# EAGLE design bread_board (EAGLE 8.3.2)
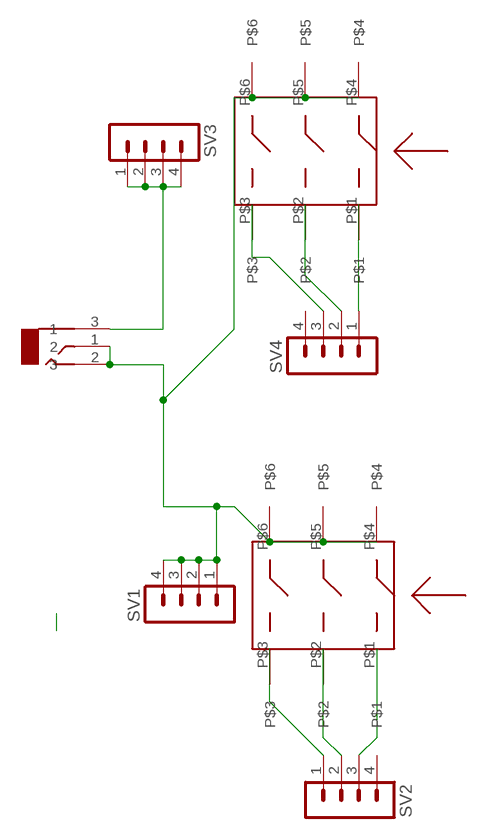
[diagram p0: schematic, sheet 1]

## Parts
J2  DC_JACK  [DC_JACK]
SV1  MA04-1  [MA04-1]
SV2  MA04-1  [MA04-1]
SV3  MA04-1  [MA04-1]
SV4  MA04-1  [MA04-1]
U$1  AUDIO_JACK  [AUDIO_JACK]
U$2  AUDIO_JACK  [AUDIO_JACK]

## Nets
GND: J2.1 J2.2 SV1.1 SV1.2 SV1.3 SV1.4 U$1.P$4 U$1.P$5 U$1.P$6 U$2.P$4 U$2.P$5 U$2.P$6
N$2: SV2.3 U$2.P$1
N$4: J2.3 SV3.1 SV3.2 SV3.3 SV3.4
N$5: SV2.2 U$2.P$2
N$6: SV2.1 U$2.P$3
N$7: SV4.1 U$1.P$1
N$8: SV4.2 U$1.P$2
N$9: SV4.3 U$1.P$3
Unconnected: SV2.4 SV4.4

## Library data of the parts
J2 = untitled:DC_JACK
SV1-SV4 = con-lstb:MA04-1: PIN HEADER; OC_FARNELL: unknown; OC_NEWARK: unknown
U$1 U$2 = untitled:AUDIO_JACK: General purpose 1/4 inch audio jack for amplifiers and pedal designs

## Board
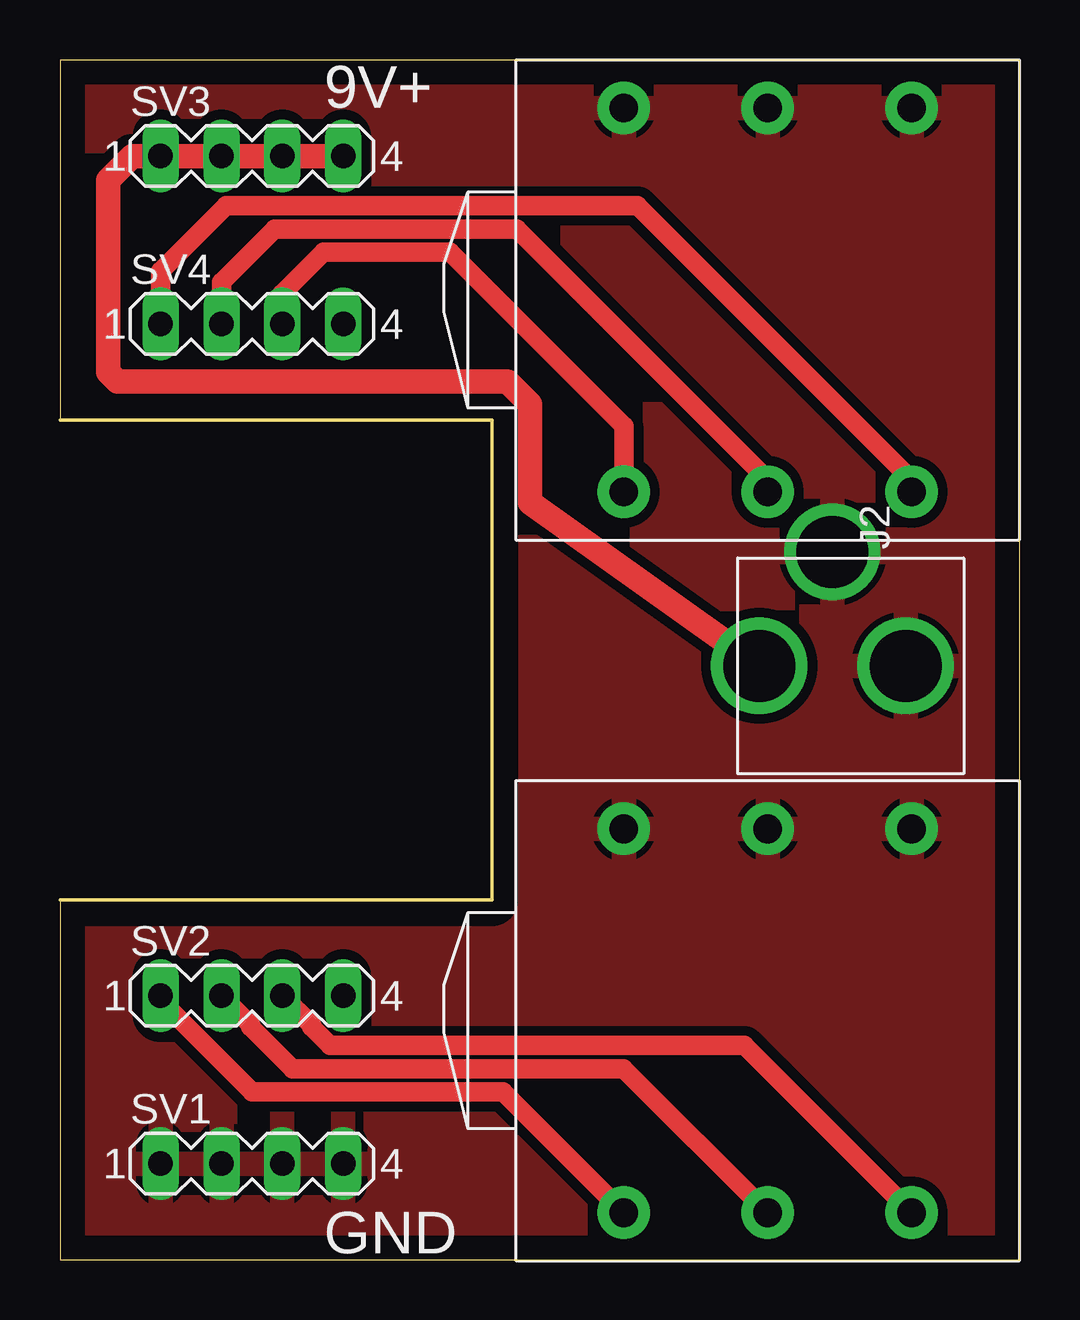
[diagram p1: board, top side]
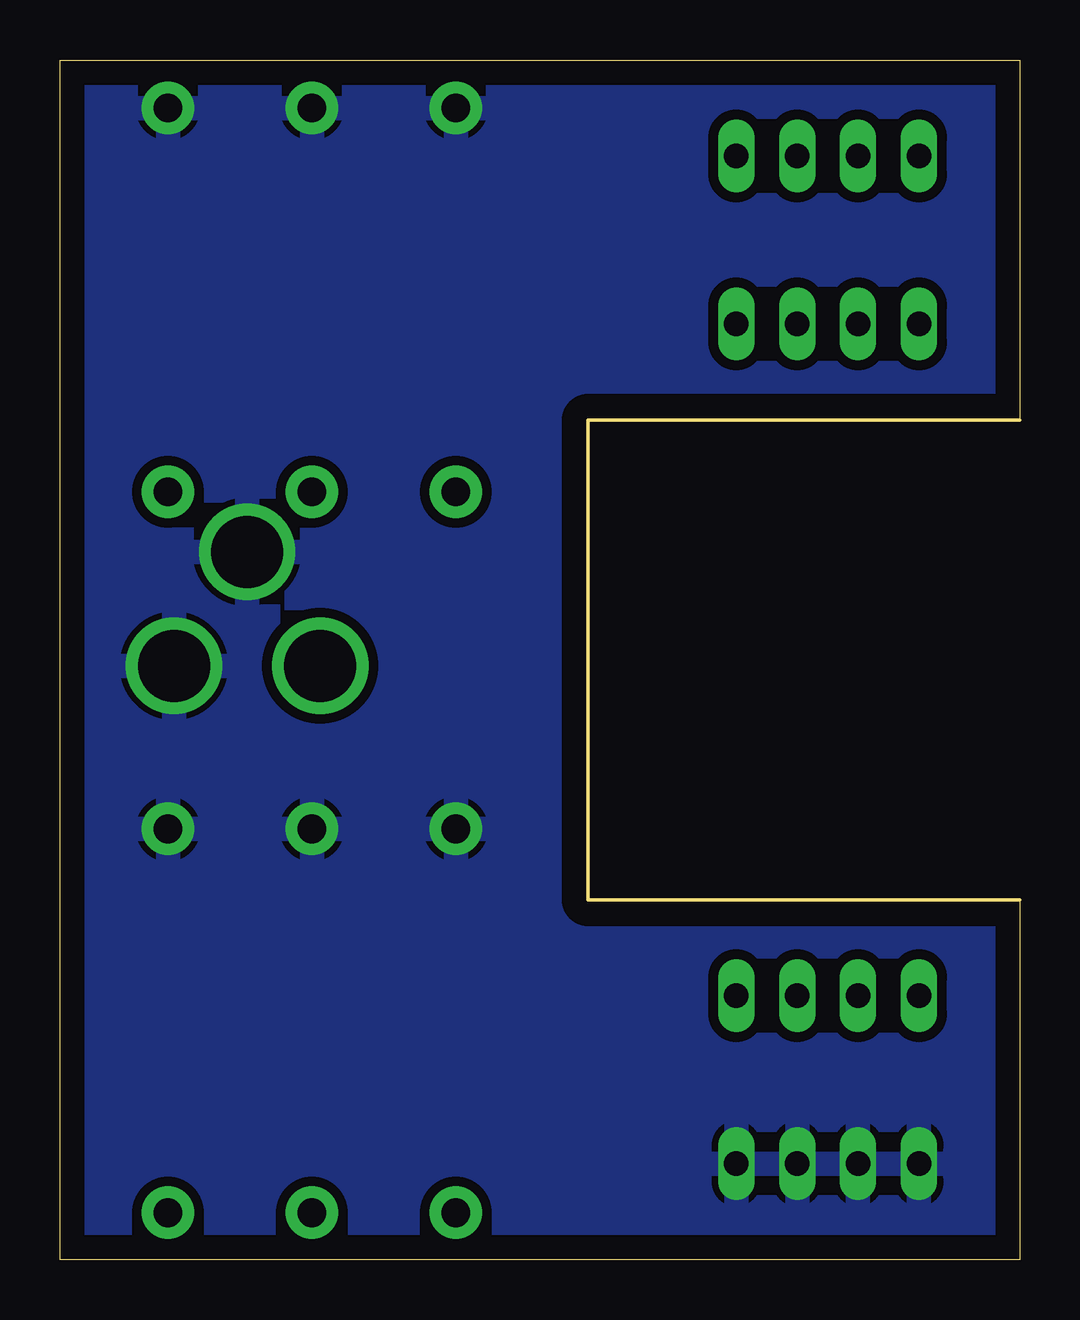
[diagram p2: board, bottom side, seen from below]

Size 40 x 50 mm. Coordinates in mm from the lower left corner, seen from the top.
Outline: 0,0 40,0 40,50 0,50 0,35 18,35 18,15 0,15 0,0
Copper layers (1*16): Top 0.035mm / dielectric 1.5mm / Bottom 0.035mm
Design rules "default": minimum track width 6mil, minimum drill 0.35mm, track to track 6mil, track to pad 6mil, pad to pad 6mil, via to via 6mil, smd to smd 6mil, copper to edge 40mil, drill to drill 6mil, minimum pad ring 10mil, minimum via ring 8mil, stop-mask expansion 4mil, vias tented up to drill 0mil, thermal gap 10mil

### Footprints (pad centres in the part's own frame; a part is rotated, then mirrored left to right if it is on the bottom)
DC_JACK = drill 3: 1 0,0; 2 -3.05,4.75; 3 -6.1,0
MA04-1 = drill 1.016 long: 1 -3.81,0; 2 -1.27,0; 3 1.27,0; 4 3.81,0
AUDIO_JACK = drill 1.2 pad 2.184: P$1 -6,8; P$2 0,8; P$3 6,8; P$4 -6,-8; P$5 0,-8; P$6 6,-8

### Placement (x,y rotation side)
J2  35.25,24.75 0 top
SV1  8,4 0 top
SV2  8,11 0 top
SV3  8,46 0 top
SV4  8,39 0 top
U$1  29.5,40 180 top
U$2  29.5,9.95 180 top

### Tracks (layer width: path | path; a pad name or v marks a point on that pad's centre or on a via)
GND
  pour Top (isolate 0.406): 1,49 1,36 19,36 19,14 1,14 1,1 39,1 39,49
  pour Bottom (isolate 0.406): 1,49 1,36 19,36 19,14 1,14 1,1 39,1 39,49
N$2
  Top 0.813: SV2.3 10.49,9.78 10.49,9.69 11.26,8.92 28.53,8.92 U$2.P$1
N$4
  Top 1.016: SV3.4 SV3.3 SV3.2 SV3.1 3,46 2,45 2,37 2.4,36.6 18.66,36.6 19.6,35.66 19.6,31.55 J2.3
N$5
  Top 0.813: SV2.2 7.95,9.78 7.95,9.69 9.69,7.95 23.5,7.95 U$2.P$2
N$6
  Top 0.813: SV2.1 4.19,10.81 8,7 9.28,7 9.29,6.99 18.46,6.99 U$2.P$3
N$7
  Top 0.813: SV4.1 4.19,41.19 6.92,43.92 24.08,43.92 35.5,32.5 U$1.P$1
N$8
  Top 0.813: SV4.2 6.73,40.73 8.95,42.95 19.05,42.95 29.5,32.5 U$1.P$2
N$9
  Top 0.813: SV4.3 9.27,40.27 10.99,41.99 16.26,41.99 23.5,34.75 U$1.P$3

### Text on the board
tPlace: 9V+ | GND